# EasyEDA schematic SCH_easyeda.json
TITLE: Sheet_1; REV: 1.0; Date: 2023-01-15; Sheet: 1/1; Drawn By: Alexey K; Company: Your Company
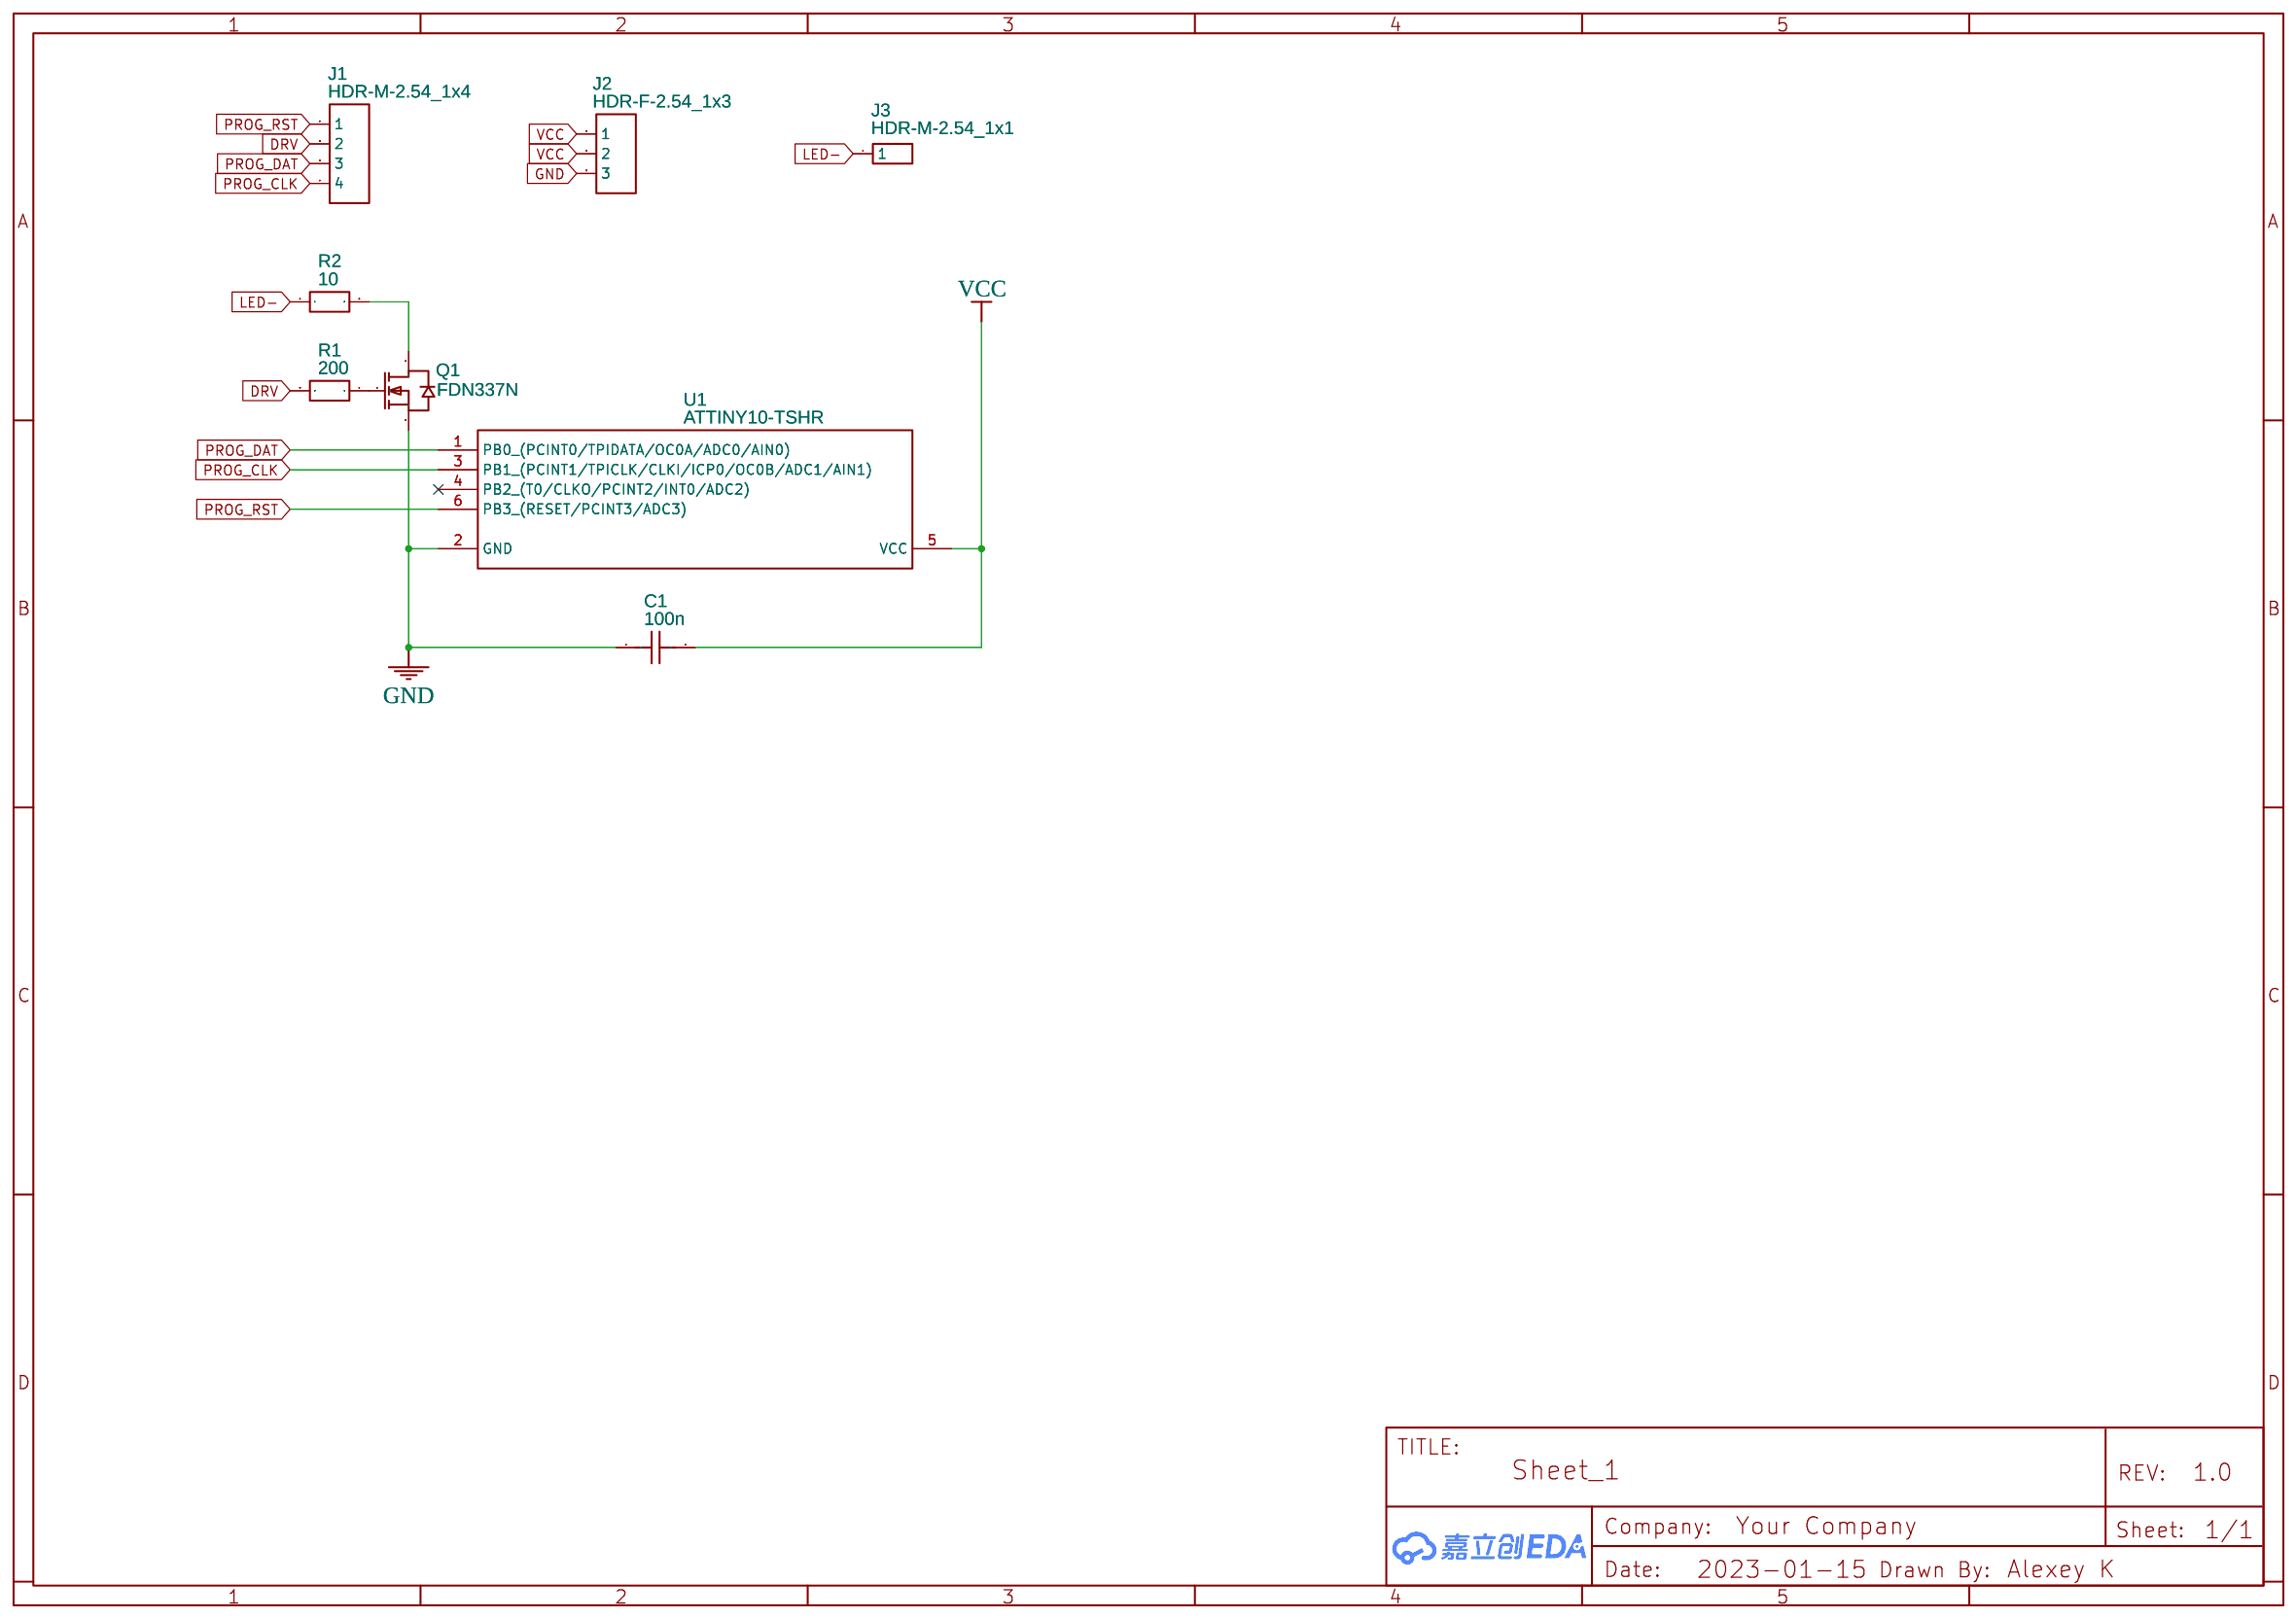
[diagram p0: schematic sheet]

## Parts
C1  100n  [C0805]
J1  HDR-M-2.54_1x4  [HDR-M-2.54_1X4]
J2  HDR-F-2.54_1x3  [HDR-F-2.54_1X3]
J3  HDR-M-2.54_1x1  [HDR-M-2.54_1X1]
Q1  FDN337N  [SOT-23-3_L2.9-W1.3-P1.90-LS2.4-BR]
R1  200  [R0805]
R2  10  [R0805]
U1  ATTINY10-TSHR  [SOT-23-6_L2.9-W1.6-P0.95-LS2.8-BR]

## Library data of the parts
C1 = C_0805_US: Contributor: LCEDA_Lib
J1 = HDR-M-2.54_1x4: Supplier Part: C124378; Supplier: LCSC; Contributor: LCEDA_Lib
J2 = HDR-F-2.54_1x3: Supplier Part: C146690; Supplier: LCSC; Contributor: LCEDA_Lib
J3 = HDR-M-2.54_1x1: Supplier Part: C81276; Supplier: LCSC; Contributor: LCEDA_Lib
Q1 = FDN337N_C5182040: Supplier: LCSC; Supplier Part: C5182040; Manufacturer: TECH PUBLIC(台舟); link: https://atta.szlcsc.com/upload/public/pdf/source/20220927/65296921BE8F4D933E1931F77DB5E53B.pdf; Contributor: lcsc
R1 R2 = R_0805_EU: Contributor: LCEDA_Lib
U1 = ATTINY10-TSHR: Supplier: LCSC; Manufacturer: MICROCHIP(美国微芯); Contributor: LCSC; Supplier Part: C128438; JLCPCB Part Class: Extended Part

## Nets
GND: C1.1 J2.3 Q1.2(S) U1.2(GND)
VCC: C1.2 J2.1 J2.2 U1.5(VCC)
DRV: J1.2 R1.2
LED-: J3.1 R2.1
PROG_CLK: J1.4 U1.3(PB1 (PCINT1/TPICLK/CLKI/ICP0/OC0B/ADC1/AIN1))
PROG_DAT: J1.3 U1.1(PB0 (PCINT0/TPIDATA/OC0A/ADC0/AIN0))
PROG_RST: J1.1 U1.6(PB3 (RESET/PCINT3/ADC3))
Net-(Q1-1): Q1.1(G) R1.1
Net-(Q1-3): Q1.3(D) R2.2

Not connected (* = marked no-connect by the designer): U1 4(PB2 (T0/CLKO/PCINT2/INT0/ADC2))*
